# Altium schematic sheet PROC051C_Hardware.SchDoc: Hardware
size 431 x 279 mm; Date: Not shown in title block; ApprovedBy: Not shown in title block; CheckedBy: Not shown in title block; Author: Not shown in title block; CompanyName: Not shown in title block; Engineer: Not shown in title block; Organization: Not shown in title block; Address1: Not shown in title block; Address2: Not shown in title block; Address3: Not shown in title block; Address4: Not shown in title block; DocumentNumber: 16; Revision: Use project parameter SCH_Rev; SheetNumber: 16; SheetTotal: 16; PageSetup: Record=PageOptions|CenterHorizontal=True|CenterVertical=True|PrintScale=1.00|XCorrection=1.00|YCorrection=1.00|PrintKind=0|BorderSize=5000000|LeftOffset=0|BottomOffset=0|Orientation=2|PaperLength=1000|PaperWidth=1000|Scale=100|PaperSource=15|PrintQuality=600|MediaType=1|DitherType=10|PaperKind=Letter|PrintScaleMode=1; CurrentTime: Not shown in title block; CurrentDate: Not shown in title block; Time: Not shown in title block; DocumentFullPathAndName: Not shown in title block; DocumentName: Not shown in title block; ModifiedDate: Not shown in title block; ImagePath: Not shown in title block
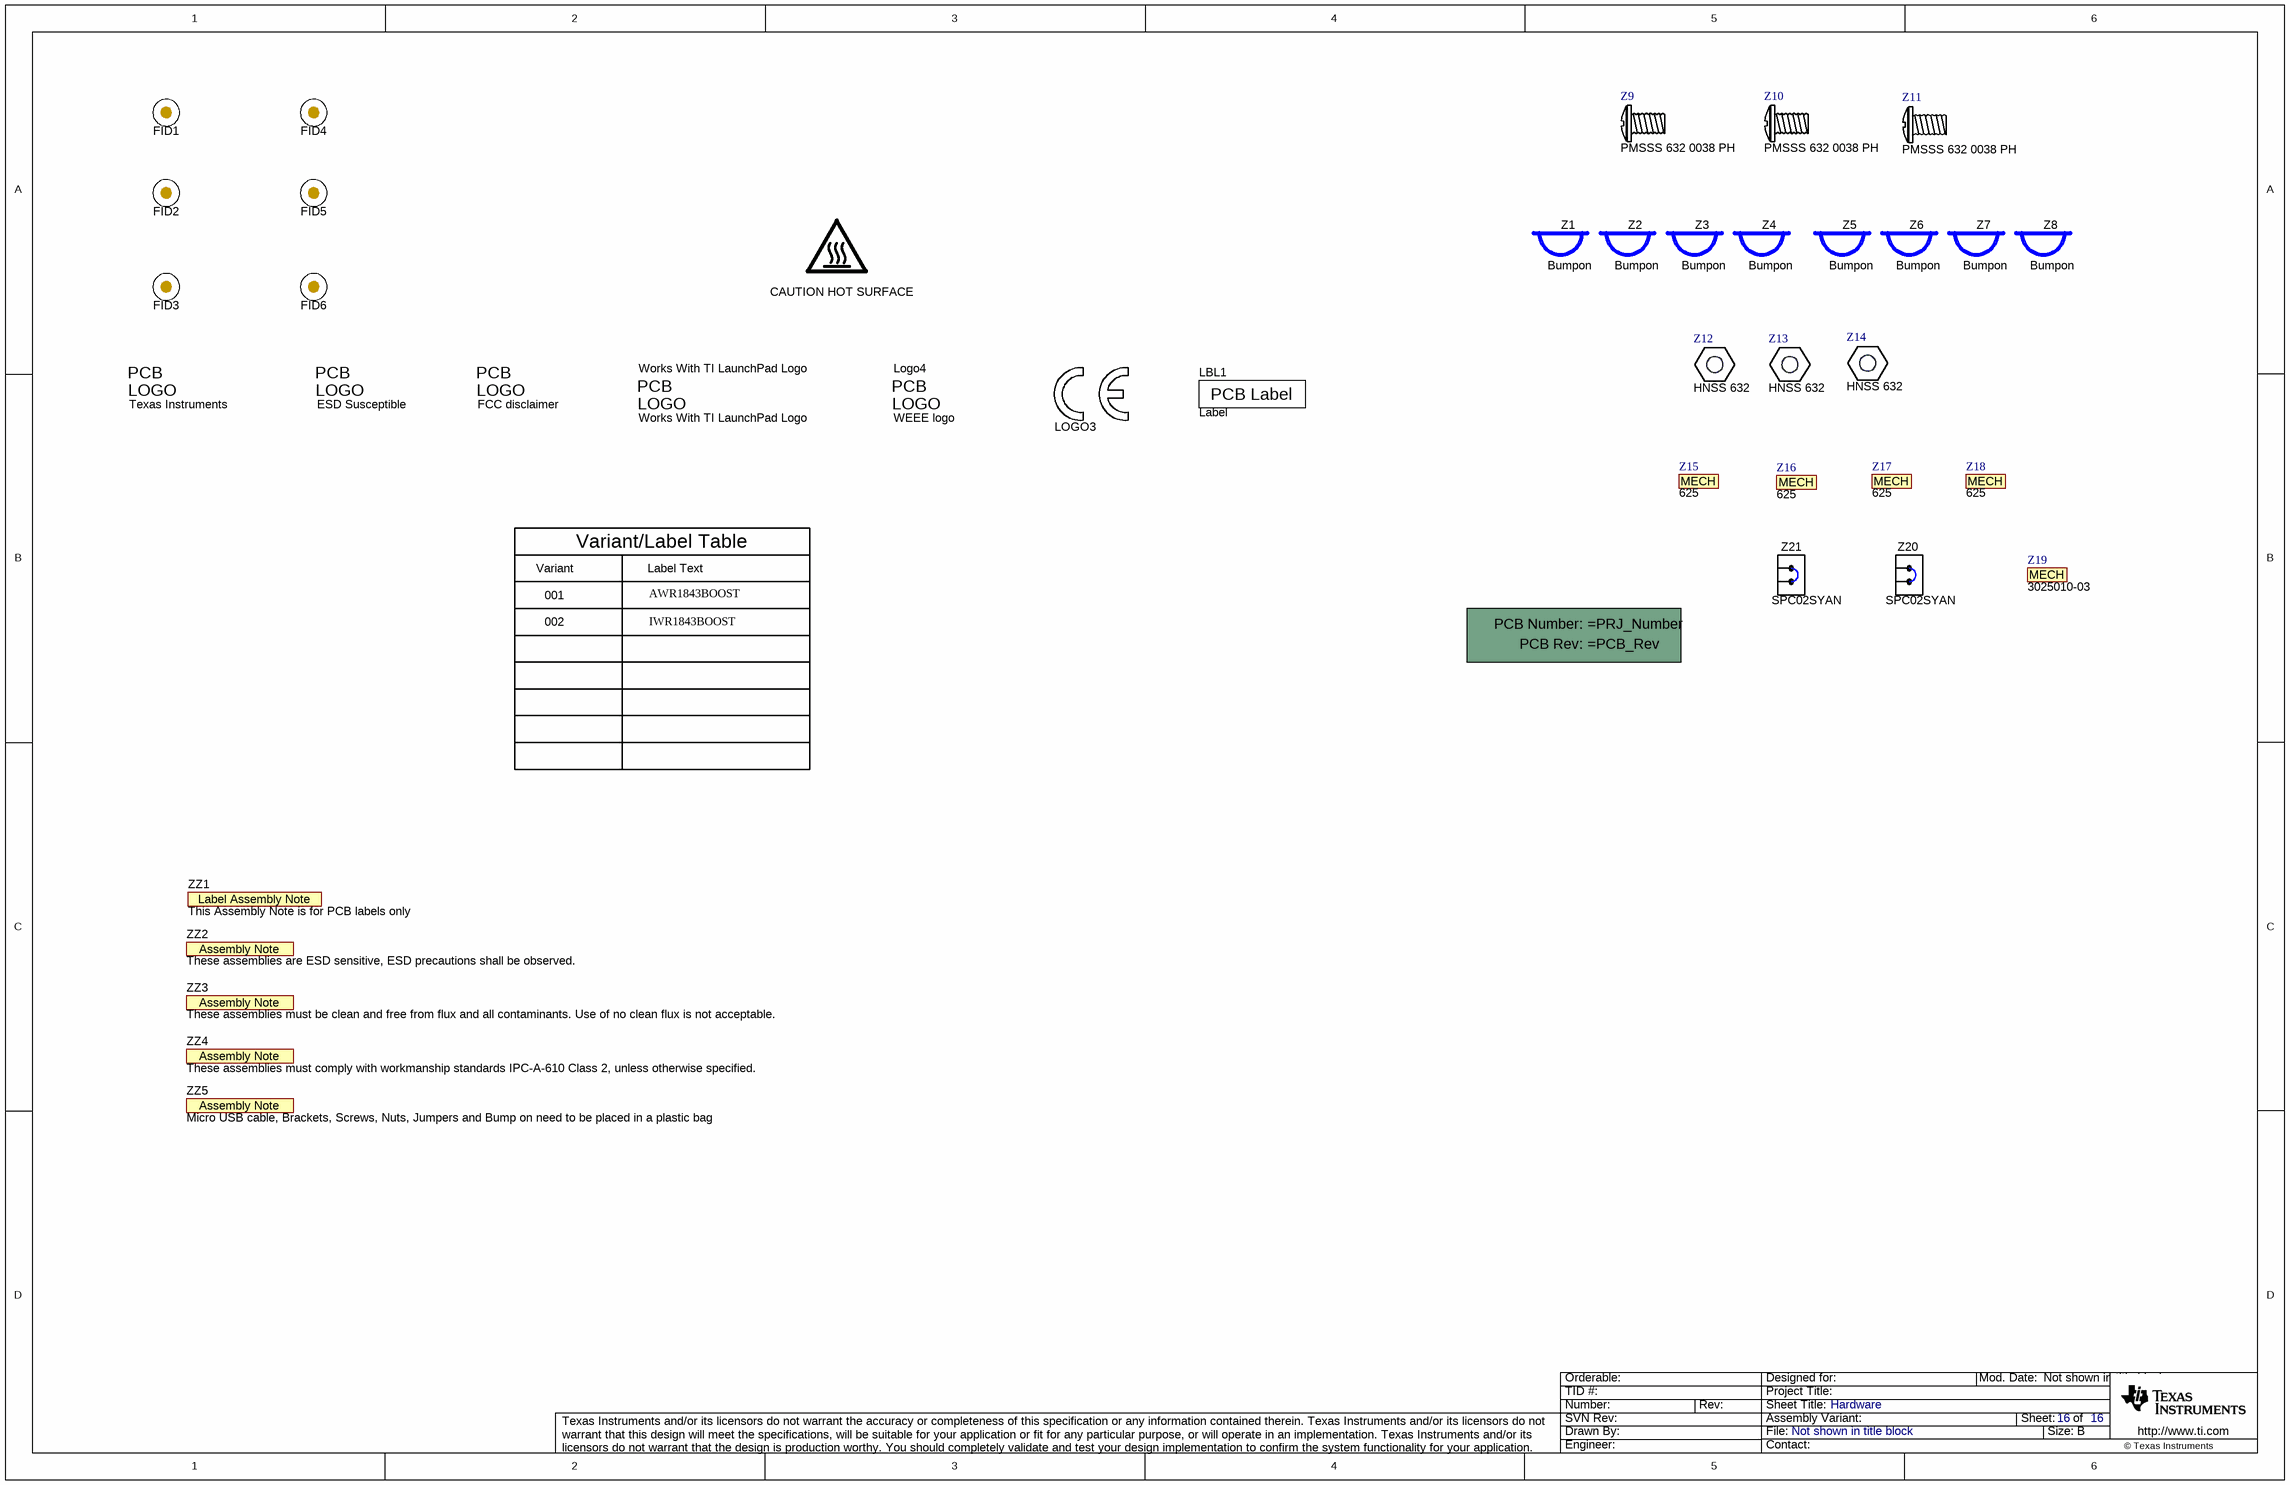
[diagram p0: PROC051C_Hardware.SchDoc]

## Parts
!PCB  PROC051  (value not drawn)  (mechanical)
CAUTION_HOT_SURFACE  CAUTION HOT SURFACE  [IEC_HotSurface_Small]  (no BOM)
ESD_Susceptible  ESD Susceptible  [ESD_Overlay_Small]  (no BOM)
FID1  Fiducial  [Fiducial10-20]  (value not drawn)
FID2  Fiducial  [Fiducial10-20]  (value not drawn)
FID3  Fiducial  [Fiducial10-20]  (value not drawn)
FID4  Fiducial  [Fiducial10-20]  (value not drawn)
FID5  Fiducial  [Fiducial10-20]  (value not drawn)
FID6  Fiducial  [Fiducial10-20]  (value not drawn)
LBL1  Label  [Label_650x200]
Logo1  Texas Instruments  [TI_Stacked_Overlay_Small]  (no BOM)
Logo2  FCC disclaimer  [FCC_disclaimer]  (no BOM)
LOGO3  CE Mark  [CE_Mark_5mm]  (value not drawn)  (no BOM)
Logo4  WEEE logo  [WEEE_Minimum]  (no BOM)
Works_With_TI_LaunchPad_Logo  Works With TI LaunchPad Logo  [WorksWithTILaunchPad]  (graphical)
Z1  Bumpon  [Bumpon_SJ61A1]  (mechanical)
Z2  Bumpon  [Bumpon_SJ61A1]  (mechanical)
Z3  Bumpon  [Bumpon_SJ61A1]  (mechanical)
Z4  Bumpon  [Bumpon_SJ61A1]  (mechanical)
Z5  Bumpon  [Bumpon_SJ61A1]  (mechanical)
Z6  Bumpon  [Bumpon_SJ61A1]  (mechanical)
Z7  Bumpon  [Bumpon_SJ61A1]  (mechanical)
Z8  Bumpon  [Bumpon_SJ61A1]  (mechanical)
Z9  PMSSS 632 0038 PH  [B-F_PMSSS_632_0038_PH]  (mechanical)
Z10  PMSSS 632 0038 PH  [B-F_PMSSS_632_0038_PH]  (mechanical)
Z11  PMSSS 632 0038 PH  [B-F_PMSSS_632_0038_PH]  (mechanical)
Z12  HNSS 632  [B-F_HNSS-632]  (mechanical)
Z13  HNSS 632  [B-F_HNSS-632]  (mechanical)
Z14  HNSS 632  [B-F_HNSS-632]  (mechanical)
Z15  625  (mechanical)
Z16  625  (mechanical)
Z17  625  (mechanical)
Z18  625  (mechanical)
Z19  3025010-03  (mechanical)
Z20  SPC02SYAN  [SPC02SYAN]  (mechanical)
Z21  SPC02SYAN  [SPC02SYAN]  (mechanical)
ZZ1  This Assembly Note is for PCB labels only  [AssemblyNoteLabel]  (no BOM)
ZZ2  These assemblies are ESD sensitive, ESD precautions shall be observed.  [AssemblyNote]  (no BOM)
ZZ3  These assemblies must be clean and free from flux and all contaminants. Use of no clean flux is not acceptable.  [AssemblyNote]  (no BOM)
ZZ4  These assemblies must comply with workmanship standards IPC-A-610 Class 2, unless otherwise specified.  [AssemblyNote]  (no BOM)
ZZ5  Micro USB cable, Brackets, Screws, Nuts, Jumpers and Bump on need to be placed in a plastic bag  [AssemblyNote]  (no BOM)

## Notes on the sheet
- Variant
- Variant/Label Table
- Label Text
- 001
- 002
- AWR1843BOOST
- IWR1843BOOST
- Drawn By:
- SVN Rev:
- Number:
- TID #:
- Orderable:
- Rev:
- Sheet Title:
- File:
- Project Title:
- Designed for:
- Assembly Variant:
- Mod. Date:
- Sheet:
- Size:
- of
- B
- http://www.ti.com
- Texas Instruments and/or its licensors do not warrant the accuracy or completeness of this specification or any information contained therein. Texas Instruments and/or its licensors do not warrant that this design will meet the specifications, will be suitable for your application or fit for any particular purpose, or will operate in an implementation. Texas Instruments and/or its licensors do not warrant that the design is production worthy. You should completely validate and test your design implementation to confirm the system functionality for your application.
- Engineer:
- Contact:
- © Texas Instruments
- (in symbol AssemblyNote) Assembly Note
- (in symbol CMP-0003616-3) Label Assembly Note
- (in symbol CMP-0003618-2) PCB Number:; PCB Rev:
- (in symbol CMP-0003625-1) PCB Label
- (in symbol CMP-0074769-1) PCB; LOGO
- (in symbol CMP-0074838-1) PCB; LOGO
- (in symbol CMP-0074840-1) PCB; LOGO
- (in symbol CMP-0074847-1) PCB; LOGO
- (in symbol CMP-0077108-1) PCB; LOGO
- (in symbol CMP-0085299-1) MECH
- (in symbol CMP-0085300-1) MECH

## Library data of the parts
!PCB = CMP-0003618-2: Printed Circuit Board; Manufacturer: Any; CompType: PCB; PartNumber: PROC051; RoHS: O; MountType: N/A; Publisher: Texas Instruments; LatestRevisionDate: 2017-03-09; Key: PCB
CAUTION_HOT_SURFACE = CMP-0074837-1: IEC 61010-1 Hot Surface Warning; Library Reference: IEC_HotSurface; SymbolCreator: a0412235; Publisher: Texas Instruments; SymbolVersion: 2011-08-22; Published: 2009-03-03; Lib Reference: IEC_HotSurface; LatestRevisionDate: 2017-07-06; PartNumber: CAUTION HOT SURFACE
ESD_Susceptible = CMP-0074840-1: ESD Susceptible Symbol; Library Reference: Logo; SymbolCreator: a0412235; Lib Reference: ESD_Susceptible; Publisher: Texas Instruments; SymbolVersion: 2011-08-22; Published: 2009-03-03; LatestRevisionDate: 2017-07-06; PartNumber: ESD Susceptible
FID1-FID6 = CMP-0077181-1: Fiducial mark.  There is nothing to buy or mount.; CompType: Fiducial; Manufacturer: N/A; MountType: N/A; PackageReference: N/A; PartNumber: N/A; ClassName: FiducialMark; Library Reference: Fiducial
LBL1 = CMP-0003625-1: Thermal Transfer Printable Labels, 0.650" W x 0.200" H - 10,000 per roll; Manufacturer: Brady; PartNumber: THT-14-423-10; Note: Size: 0.65" x 0.20 "; ClassName: Label; CompType: Label; RoHS: Y; PackageReference: PCB Label 0.650 x 0.200 inch; MountType: N/A; ComponentLink1Description: Web Page; ComponentLink1URL: http://www.bradyid.com/bradyid/pdpv/THT-14-423-10.html; Publisher: Texas Instruments; LatestRevisionDate: 2017-03-09; Supplier 1: Newark; Supplier Part Number 1: 97C5133; Supplier 2: Farnell; Supplier Part Number 2: 2065596; Key: THT-14-423-10
Logo1 = CMP-0074838-1: Texas Instrument Corporate Signature; SymbolCreator: a0412235; Lib Reference: TI_Logo; Library Reference: Logo; SymbolVersion: 2011-08-22; Published: 2009-03-03; Publisher: Texas Instruments; ClassName: Logo; LatestRevisionDate: 2017-07-06; PartNumber: Texas Instruments
Logo2 = CMP-0074847-1: FCC_disclaimer; Library Reference: Logo; Published: 2009-03-03; Publisher: Texas Instruments; LatestRevisionDate: 2017-07-06; Lib Reference: FCC_disclaimer; PartNumber: FCC disclaimer
LOGO3 = CMP-0074844-1: SymbolCreator: a0412235; Published: 2009-03-03; Publisher: Texas Instruments; LatestRevisionDate: 2017-07-06; Lib Reference: CE Mark; PartNumber: CE Mark; Library Reference: CE Mark
Logo4 = CMP-0074769-1: Library Reference: WEEE logo; Lib Reference: WEEE logo; PartNumber: WEEE logo
Works_With_TI_LaunchPad_Logo = CMP-0077108-1: Publisher: Texas Instruments; LatestRevisionDate: 2017-07-28; Lib Reference: Works With TI LaunchPad; Library Reference: Logo; Published: 2009-03-03
Z1-Z8 = CMP-0003621-1: Bumpon, Cylindrical, 0.312 X 0.200, Black; Manufacturer: 3M; PartNumber: SJ61A1; CompType: Bumpon; RoHS: Y; PackageReference: Black Bumpon; MountType: N/A; ComponentLink1Description: Datasheet Link; ComponentLink1URL: http://multimedia.3m.com/mws/mediawebserver?mwsId=66666UF6EVsSyXTtOxTXoxMtEVtQEVs6EVs6EVs6E666666--&fn=SJxxA1.pdf; Publisher: Texas Instruments; LatestRevisionDate: 2017-03-09; Supplier 1: Digi-Key; Supplier Part Number 1: SJ5746-0-ND; Supplier 2: Mouser; Supplier Part Number 2: 517-SJ-61A1; Key: SJ61A1
Z9-Z11 = CMP-0003820-1: MACHINE SCREW PAN PHILLIPS 6-32; Manufacturer: B&F Fastener Supply; Note: Symbol and footprint updated; CompType: Hardware; ComponentLink1URL: http://www.fasnetdirect.com/refguide/Machinepancombo.pdf; Key: PMSSS 632 0038 PH; Publisher: Texas Instruments; Supplier 1: Digi-Key; LatestRevisionDate: 2017-03-09; RoHS: Y; Supplier Part Number 1: H710-ND; MountType: TH; PartNumber: PMSSS 632 0038 PH; ComponentLink1Description: Datasheet Link
Z12-Z14 = CMP-0067637-3: Nut, Hex, 5/16", Stainless Steel, 6-32; Manufacturer: B&F Fastener Supply; ComponentLink1URL: http://www.fasnetdirect.com/refguide/Nutshexmachine.pdf; Supplier 1: Digi-Key; CompType: Nut; PackageReference: Hex Nut; RoHS: Y; Supplier Part Number 1: H725-ND; MountType: N/A; PartNumber: HNSS 632; ComponentLink1Description: Datasheet Link
Z15-Z18 = CMP-0085300-1: Aluminum Mounting Bracket; Manufacturer: Keystone; ComponentLink1URL: https://media.digikey.com/pdf/Data%20Sheets/Keystone%20Electronics%20PDFs/ClearHoleMountingBrackets.pdf; RoHS: Y; PartNumber: 625; ComponentLink1Description: Datasheet Link; MountType: N/A; CompType: Bracket
Z19 = CMP-0085299-1: Cable, USB A Male to Micro B Male 3'; Manufacturer: Qualtek Electronics Corporation; RoHS: Y; PartNumber: 3025010-03; MountType: N/A; ComponentLink1URL: http://www.qualtekusa.com/images/Cable%20Assemblies/PDF_2/3025010-03.pdf; ComponentLink1Description: Datasheet Link; CompType: Cable
Z20 Z21 = CMP-0003642-1: Shunt, 100mil, Flash Gold, Black; Manufacturer: Sullins Connector Solutions; Value: 1x2; Note: You can "mate" this to a header by matching the designator.  i.e. use SH-J3 for header J3; CompType: Shunt; ClassName: Shunt; PartNumber: SPC02SYAN; RoHS: Y; PackageReference: Closed Top 100mil Shunt; MountType: N/A; ComponentLink1Description: Datasheet Link; ComponentLink1URL: http://www.sullinscorp.com/drawings/134_C02SYAN_11134.pdf; Publisher: Texas Instruments; LatestRevisionDate: 2017-03-09; Supplier 1: Digi-Key; Supplier Part Number 1: S9001-ND; Key: SPC02SYAN
ZZ1 = CMP-0003616-3: CompType: AssemblyNote; ClassName: AssemblyNote; Publisher: Texas Instruments; LatestRevisionDate: 2017-03-09; Key: AssemblyNoteLabel
ZZ2 = CMP-0077236-1: CompType: AssemblyNote; ClassName: AssemblyNote; Publisher: Texas Instruments; LatestRevisionDate: 2017-08-10; Key: AssemblyNote
ZZ3 = CMP-0077237-1: CompType: AssemblyNote; ClassName: AssemblyNote; Publisher: Texas Instruments; LatestRevisionDate: 2017-08-10; Key: AssemblyNote
ZZ4 = CMP-0077238-1: CompType: AssemblyNote; ClassName: AssemblyNote; Publisher: Texas Instruments; LatestRevisionDate: 2017-08-10; Key: AssemblyNote
ZZ5 = AssemblyNote: SymbolCreator: codlsc; SymbolVersion: 2010-05-18; CompType: AssemblyNote; ClassName: AssemblyNote; Publisher: Texas Instruments; LatestRevisionDate: 2012-06-14; LatestRevisionNote: Initial Version; Alternate Manufacturer: -; Alternate PartNumber: -